# EasyEDA Pro project AQM2b.epro

# Schematic Schematic2
Board Name: Board2; Create Date: 2026-05-22; Page Name: P1; Project Name: AQM2; Schematic Name: Schematic2; Update Date: 2026-05-22; Company: EasyEDA.com; Page Size: A4; Version: V1.0
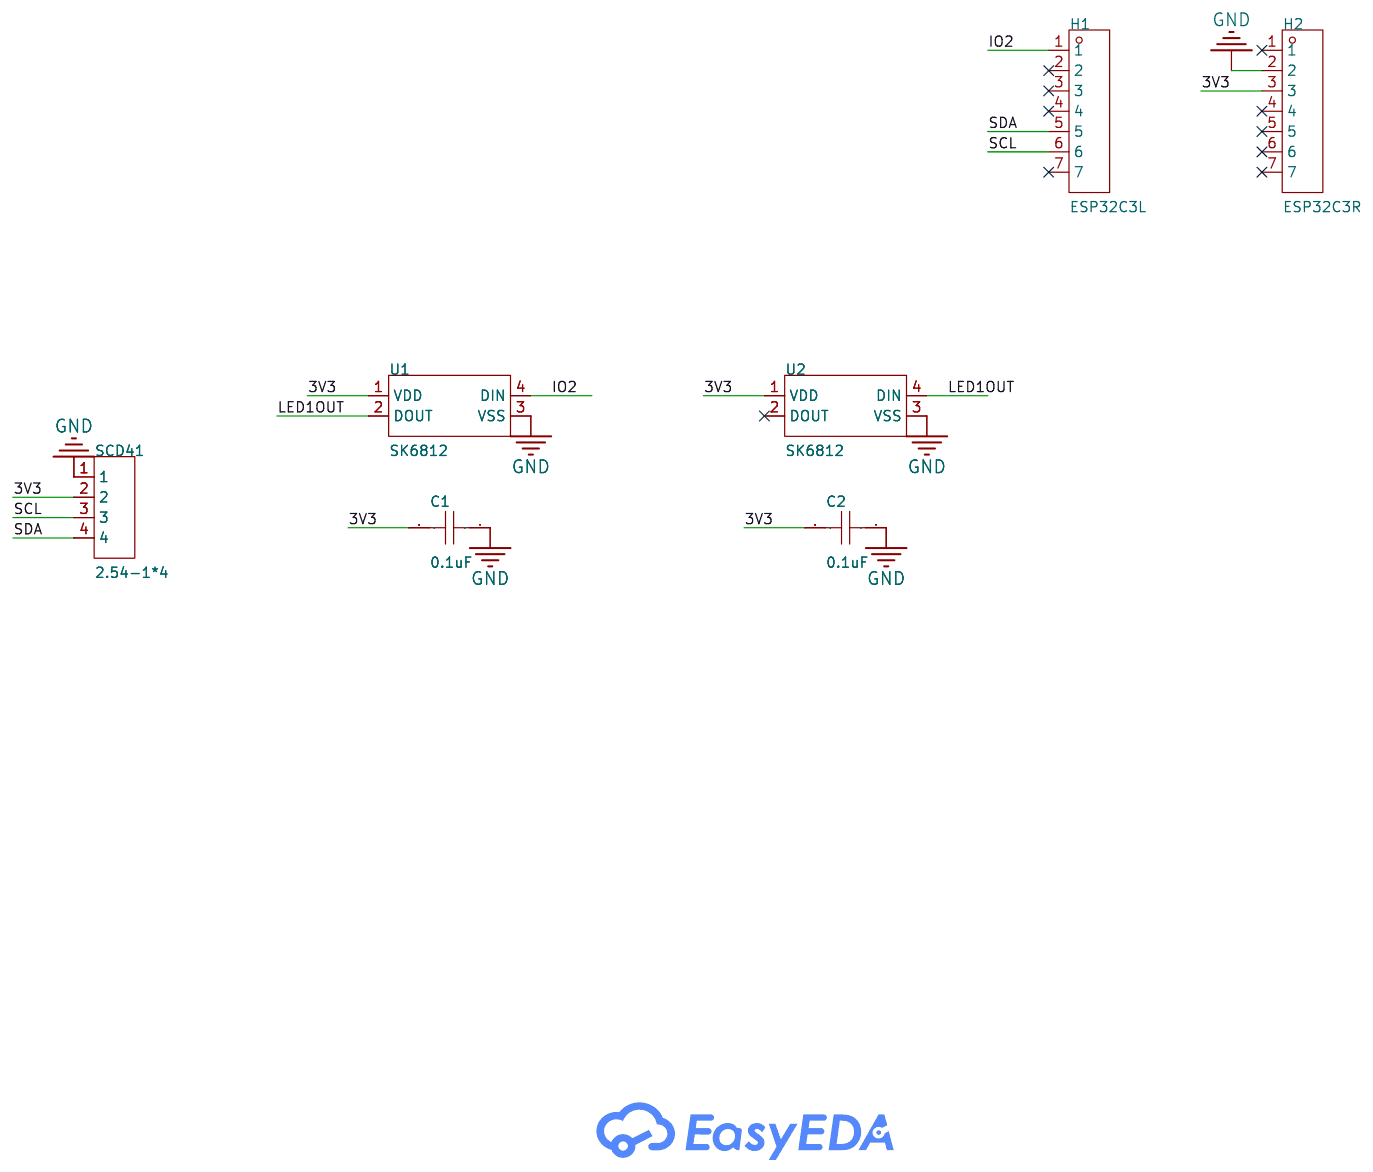
[diagram p0: schematic sheet]

## Parts
C1  0.1uF  [C0603]
C2  0.1uF  [C0603]
H1  ESP32C3L  [HDR-TH_7P-P2.54-V-M]
H2  ESP32C3R  [HDR-TH_7P-P2.54-V-M]
SCD41  2.54-1*4  [HDR-TH_4P-P2.54-V-M-1]
U1  SK6812  [LED-SMD_4P-L5.0-W5.0-LS5.4-TL-1]
U2  SK6812  [LED-SMD_4P-L5.0-W5.0-LS5.4-TL-1]

## Library data of the parts
C1 C2 = CAP_0603: Supplier Footprint: 0603
H1 H2 = HX PZ2.54-1x7P ZZ: Pin Structure:1x7P Pitch:2.54mm Row Spacing:- Circluar Pins/Square Pins:Pin Header Mounting Type:Through Hole Number of Rows:1 Number of Pins:7P Current Rating:3A Voltage Rating (Max):1kV Length of Mating Pin:6mm Insulation Height:2.5mm Length of End Conn; LCSC Part Name: 1x7P 间距:2.54mm 方针 直插; Supplier Part: C32713273; Manufacturer: hanxia(韩下); Supplier Footprint: 插件,P=2.54mm; JLCPCB Part Class: Extended Part; Datasheet: https://item.szlcsc.com/datasheet/HX%2520PZ2.54-1x7P%2520ZZ/34444553.html; Supplier: LCSC; Pin Structure: 1x7P; Pitch: 2.54mm; Circluar Pins/Square Pins: Pin Header; Mounting Type: Through Hole; Number of Rows: 1; Number of Pins: 7P; Current Rating: 3A; Voltage Rating (Max): 1kV; Length of Mating Pin: 6mm; Insulation Height: 2.5mm; Length of End Connection Pin: 3mm; Contact Material: Brass; Contact Plating: Gold; Operating Temperature: -40℃~+105℃; Color: Black
SCD41 = 2.54-1*4: Pin Structure:1x4P Pitch:2.54mm Circluar Pins/Square Pins:Pin Header Mounting Type:Through Hole Number of Rows:1 Number of Pins:4P Current Rating:2.5A Length of Mating Pin:6mm Insulation Height:2.54mm Length of End Connection Pin:3mm Contact Material:Bras; LCSC Part Name: 1x4P 间距:2.54mm 方针 直插; Supplier Part: C5116483; Manufacturer: ZHOURI(洲日); Supplier Footprint: 插件,P=2.54mm; JLCPCB Part Class: Extended Part; Datasheet: https://item.szlcsc.com/datasheet/2.54-1*4/5692726.html; Supplier: LCSC; Pin Structure: 1x4P; Pitch: 2.54mm; Circluar Pins/Square Pins: Pin Header; Mounting Type: Through Hole; Number of Rows: 1; Number of Pins: 4P; Current Rating: 2.5A; Length of Mating Pin: 6mm; Insulation Height: 2.54mm; Length of End Connection Pin: 3mm; Contact Material: Brass; Contact Plating: Gold; Operating Temperature: -40℃~+105℃
U1 U2 = SK6812_C5378720: Wavelength:R:620nm~625nm；B:460nm~470nm；G:520nm~530nm Luminous Intensity:B:160mcd~320mcd；R:280mcd~515mcd；G:815mcd~1275mcd Fixed-Frequency Pwm Mode:1kHz Data Transmission Rate:800Kbit/s Voltage - Supply:3.7V~5.5V Voltage - Supply:3.7V~5.5V Quiescent Current; LCSC Part Name: 5.4x5.0x1.6毫米0.2W智能外控表面贴装SMD型LED; Supplier Part: C5378720; Manufacturer: 欧思科光电; Supplier Footprint: SMD-4P,5.4x5mm; JLCPCB Part Class: Extended Part; Datasheet: https://item.szlcsc.com/datasheet/SK6812/6242291.html; Supplier: LCSC; Wavelength: R:620nm~625nm；B:460nm~470nm；G:520nm~530nm; Luminous Intensity: B:160mcd~320mcd；R:280mcd~515mcd；G:815mcd~1275mcd; Fixed-Frequency Pwm Mode: 1kHz; Data Transmission Rate: 800Kbit/s; Voltage - Supply: 3.7V~5.5V; Quiescent Current: 0.6mA; Lens Color: Semi-transparent lens; ESD Withstand Voltage: 2000V; Operating Temperature: -40℃~+85℃; Viewing Angle: 120°; Height: 1.6mm

## Nets
3V3: C1.2 C2.2 H2.3 SCD41.2 U1.1(VDD) U2.1(VDD)
GND: C1.1 C2.1 H2.2 SCD41.1 U1.3(VSS) U2.3(VSS)
IO2: H1.1 U1.4(DIN)
LED1OUT: U1.2(DOUT) U2.4(DIN)
SCL: H1.6 SCD41.3
SDA: H1.5 SCD41.4

Not connected (* = marked no-connect by the designer): H1 2* 3* 4* 7*; H2 1* 4* 5* 6* 7*; U2 2(DOUT)*

# Board PCB2
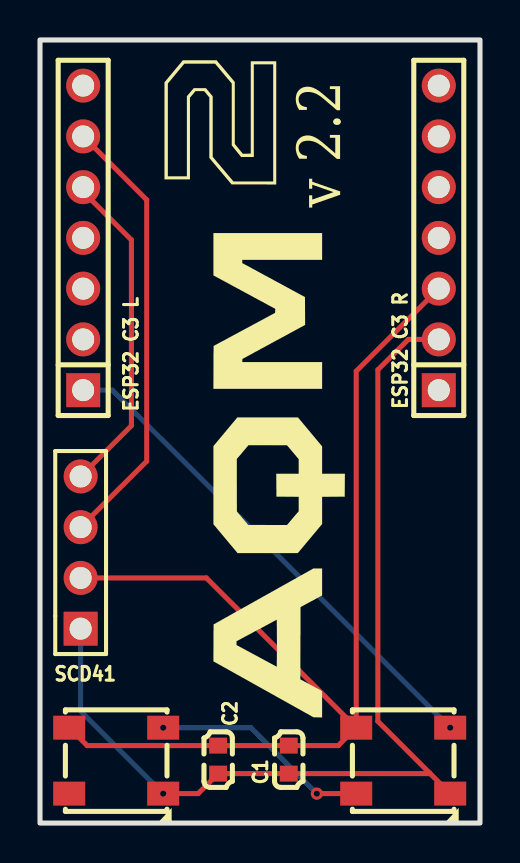
[diagram p1: board, top side]
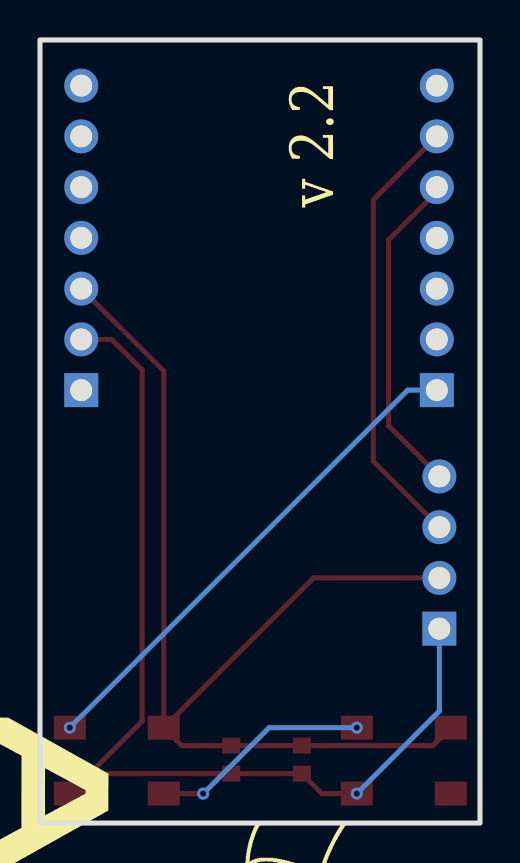
[diagram p2: board, bottom side, seen from below]

Outline 22 x 39.19 mm; copper layers: Top Layer, Bottom Layer. Coordinates in mm from the lower left corner of the outline.
Outline path: rectangle 0,39.19 22,0
Stack: Top Layer 0.035mm / Dielectric1 1.51mm FR4 er 4.5 / Bottom Layer 0.035mm

## Design rules (mm)
template: JLCPCB Capability(Two Layers Board)
spacing copperThickness1oz (default): track to track 0.102, other pairs 0.152 to 0.3
spacing copperThickness2oz: track to track 0.203, other pairs 0.152 to 0.3
track width copperThickness1oz (default): min 0.127, default 0.254, max 2.54
track width copperThickness2oz: min 0.203, default 0.254, max 2.54
differential pair differentialPair (default): width min 0.127, default 0.254, max 2.54; gap min 0.152, default 0.152
via viaSize (default): diameter min 0.5, default 0.61, max 10; hole min 0.3, default 0.305, max 6.3

## Placement (name value [footprint] x y rotation side)
C1  0.1uF  [C0603]  12.44 3.17 90 top
C2  0.1uF  [C0603]  8.91 3.17 90 top
ESP32 C3 L  ESP32C3L  [HDR-TH_7P-P2.54-V-M]  2.16 29.28 90 top
ESP32 C3 R  ESP32C3R  [HDR-TH_7P-P2.54-V-M]  19.94 29.28 90 top
SCD41  2.54-1*4  [HDR-TH_4P-P2.54-V-M-1]  2.03 13.54 90 top
U1  SK6812  [LED-SMD_4P-L5.0-W5.0-LS5.4-TL-1]  18.16 3.12 0 top
U2  SK6812  [LED-SMD_4P-L5.0-W5.0-LS5.4-TL-1]  3.81 3.12 0 top

## Footprints (pads in the part's own frame, mm; a bottom-side part is the same pattern mirrored in y, then rotated)
C0603
  rect 0.8x0.9 smd: 1(-0.7,0) 2(0.7,0)
HDR-TH_4P-P2.54-V-M-1
  rect 1.7x1.7 hole 1.1: 1(-3.81,0)
  round 1.7 hole 1.1: 2(-1.27,0) 3(1.27,0) 4(3.81,0)
HDR-TH_7P-P2.54-V-M
  rect 1.7x1.7 hole 1.1: 1(-7.62,0)
  round 1.7 hole 1.1: 2(-5.08,0) 3(-2.54,0) 4(0,0) 5(2.54,0) 6(5.08,0) 7(7.62,0)
LED-SMD_4P-L5.0-W5.0-LS5.4-TL-1
  rect 1.6x1.2 smd: 1(-2.35,1.65) 2(-2.35,-1.65) 3(2.35,-1.65) 4(2.35,1.65)

## Nets
3V3: C1.2 C2.2 ESP32 C3 R.3 SCD41.2 U1.1 U2.1
GND: C1.1 C2.1 ESP32 C3 R.2 SCD41.1 U1.3 U2.3
IO2: ESP32 C3 L.1 U1.4
LED1OUT: U1.2 U2.4
SCL: ESP32 C3 L.6 SCD41.3
SDA: ESP32 C3 L.5 SCD41.4

Pads without a net: ESP32 C3 L 2 3 4 7; ESP32 C3 R 1 4 5 6 7; U2 2

## Via types
v1: diameter 0.61, hole 0.305, Top Layer to Bottom Layer, 4 vias

## Routing (per net, layer and track width the routed paths; a pad name or vN(x,y) marks a point on that pad's centre or on a via; arc(x,y) is an arc through that point)
3V3: length 55.7
  Top Layer w0.254: U1.1 14.91,3.87 C1.2 C2.2 2.36,3.87 U2.1 ; U1.1 8.32,12.27 2.03,12.27 ; U1.1 15.81,22.62 19.94,26.75
GND: length 50.1
  Top Layer w0.254: 19.51,2.47 16.89,5.09 16.89,22.68 18.41,24.2 ESP32 C3 R.2 ; 19.51,2.47 C1.1 C2.1 7.91,1.47 v1(6.16,1.47) ; 19.51,2.47 U1.3
  Bottom Layer w0.254: v1(6.16,1.47) 2.03,5.6 SCD41.1
IO2: length 25.3
  Bottom Layer w0.254: v1(20.51,4.77) 3.62,21.67 2.16,21.67
LED1OUT: length 11
  Top Layer w0.254: v1(13.84,1.47) 15.81,1.47
  Bottom Layer w0.254: v1(6.16,4.77) 10.54,4.77 v1(13.84,1.47)
SCL: length 22.2
  Top Layer w0.254: SCD41.3 5.33,18.11 5.33,31.19 ESP32 C3 L.6
SDA: length 16.5
  Top Layer w0.254: 2.03,17.35 4.57,19.89 4.57,29.18 2.16,31.6 ESP32 C3 L.5

## Text on the board
Bottom Silkscreen Layer: v 2.2
Top Silkscreen Layer: v 2.2
